# EAGLE design i2c_io_expander (EAGLE 7.5.0)
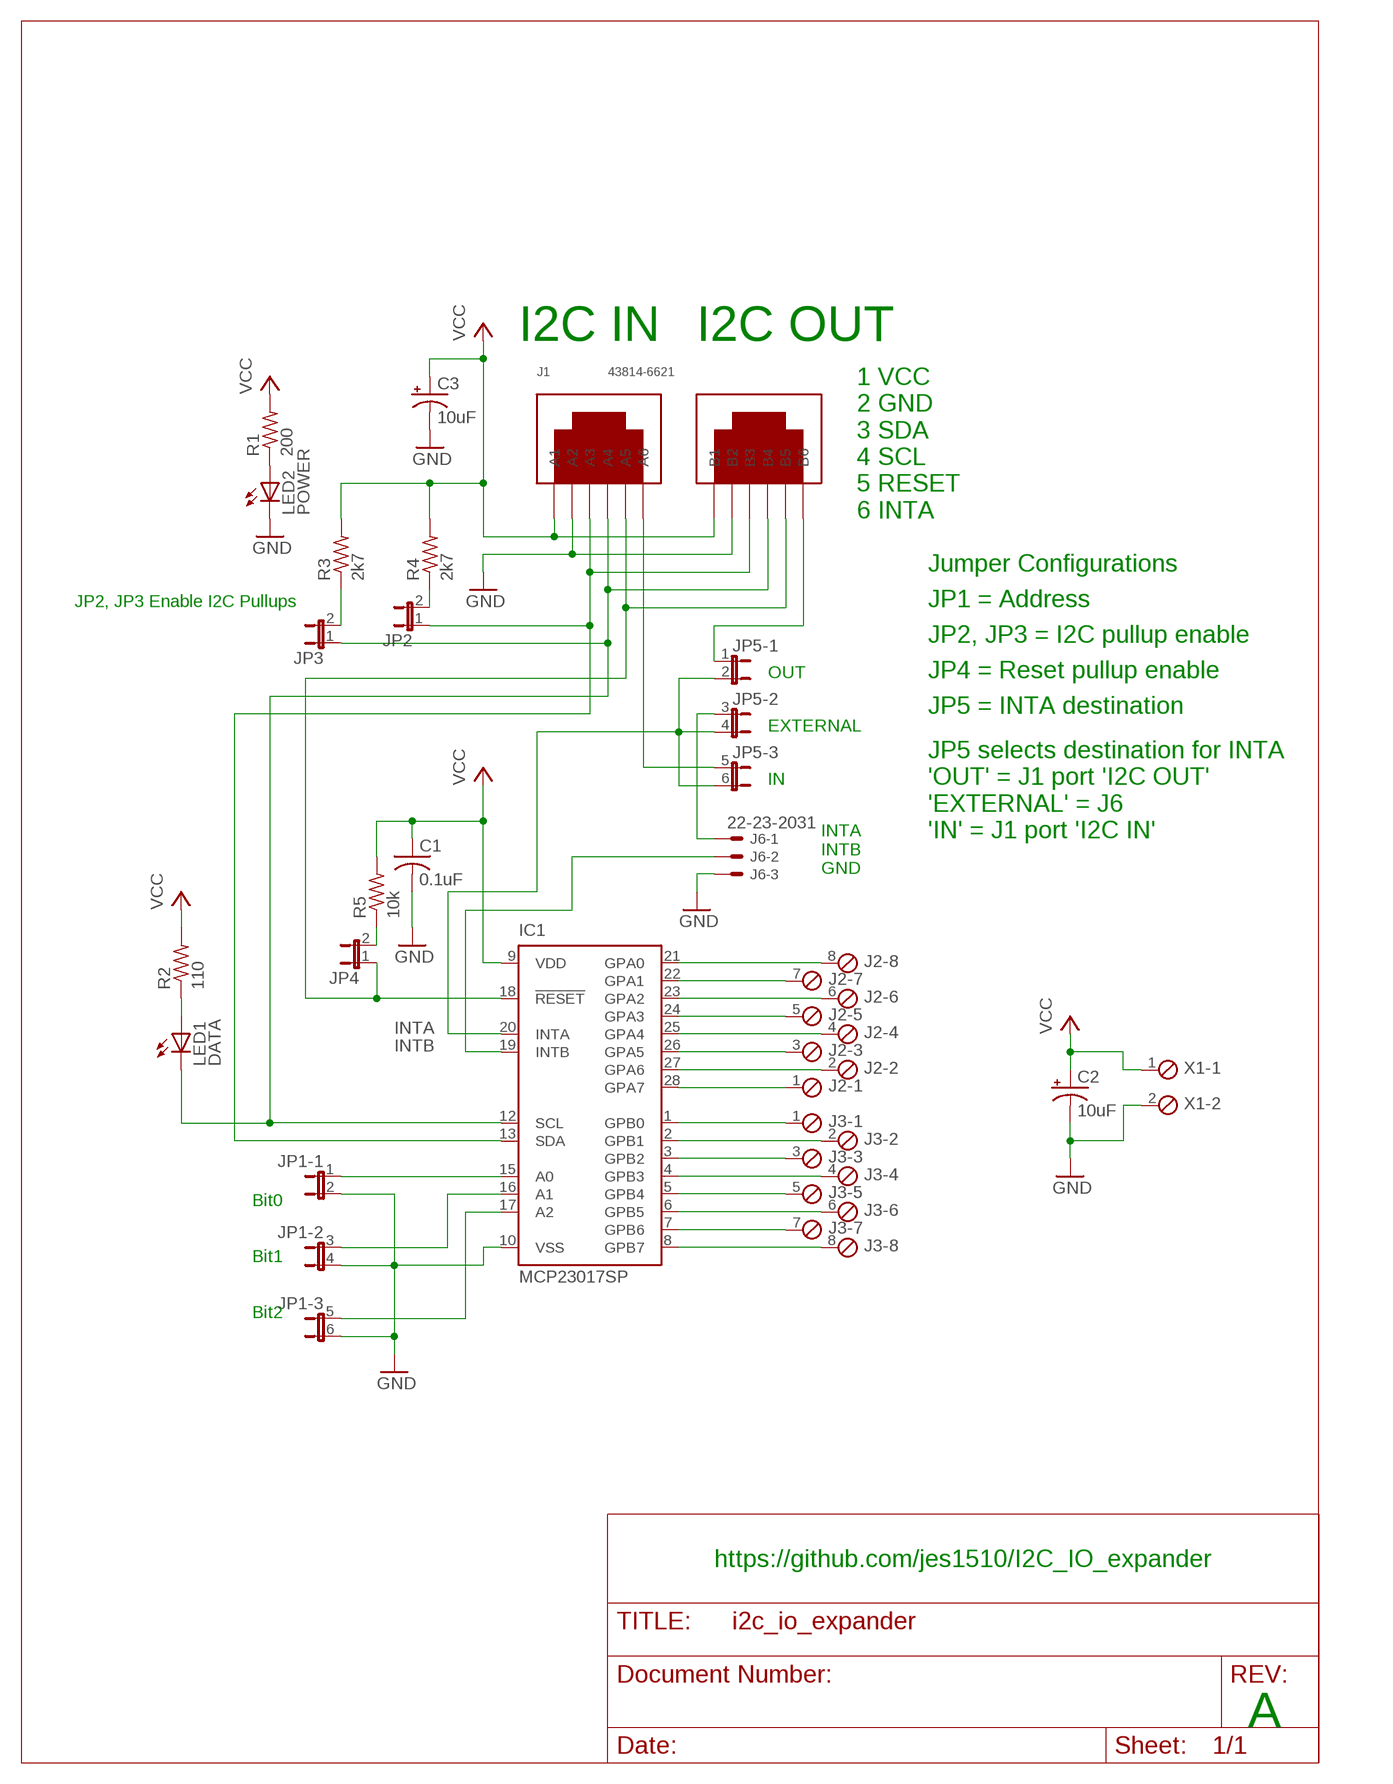
[diagram p0: schematic, sheet 1]

## Parts
C1  0.1uF  C-US025-025X050  [C025-025X050]
C2  10uF  CPOL-USE5-6  [E5-6]
C3  10uF  CPOL-USE5-6  [E5-6]
IC1  MCP23017SP  [DIL28-3]
J1  43814-6621  [43814-6621]
J2  MPT8  [8POL254]
J3  MPT8  [8POL254]
J6  22-23-2031  [22-23-2031]
JP1  JP3QE  [JP3Q]
JP2  JP1E  [JP1]
JP3  JP1E  [JP1]
JP4  JP1E  [JP1]
JP5  JP3QE  [JP3Q]
LED1  DATA  LED  [SMARTLED-TTW]
LED2  POWER  LED  [SMARTLED-TTW]
R1  200  R-US_R0603  [R0603]
R2  110  R-US_R0603  [R0603]
R3  2k7  R-US_R0603  [R0603]
R4  2k7  R-US_R0603  [R0603]
R5  10k  R-US_R0603  [R0603]
X1  MPT2  [2POL254]

## Nets
GND: C1.2 C2.- C3.- IC1.10(VSS) J1.A2 J1.B2 J6.3 JP1.2 JP1.4 JP1.6 LED2.C@1(C) X1.2
INTA: IC1.20(INTA) JP5.2 JP5.4 JP5.6
INTB: IC1.19(INTB) J6.2
N$1: IC1.15(A0) JP1.1
N$2: IC1.16(A1) JP1.3
N$3: IC1.17(A2) JP1.5
N$4: LED2.A@1(A) R1.1
N$5: J1.B6 JP5.1
N$6: JP3.2 R3.1
N$7: JP4.2 R5.1
N$8: J6.1 JP5.3
N$9: JP2.2 R4.1
N$10: LED1.A@1(A) R2.1
N$11: IC1.28(GPA7) J2.1
N$12: IC1.27(GPA6) J2.2
N$13: IC1.26(GPA5) J2.3
N$14: J1.A6 JP5.5
N$15: IC1.25(GPA4) J2.4
N$16: IC1.24(GPA3) J2.5
N$17: IC1.23(GPA2) J2.6
N$18: IC1.22(GPA1) J2.7
N$19: IC1.21(GPA0) J2.8
N$20: IC1.1(GPB0) J3.1
N$21: IC1.2(GPB1) J3.2
N$22: IC1.3(GPB2) J3.3
N$23: IC1.4(GPB3) J3.4
N$24: IC1.5(GPB4) J3.5
N$25: IC1.6(GPB5) J3.6
N$26: IC1.7(GPB6) J3.7
N$27: IC1.8(GPB7) J3.8
RESET: IC1.18(!RESET) J1.A5 J1.B5 JP4.1
SCL: IC1.12(SCL) J1.A4 J1.B4 JP3.1 LED1.C@1(C)
SDA: IC1.13(SDA) J1.A3 J1.B3 JP2.1
VCC: C1.1 C2.+ C3.+ IC1.9(VDD) J1.A1 J1.B1 R1.2 R2.2 R3.2 R4.2 R5.2 X1.1

## Notes on the sheet
- I2C IN | I2C OUT
- 1 VCC
  2 GND
  3 SDA
  4 SCL
  5 RESET
  6 INTA
- Jumper Configurations
- JP2, JP3 Enable I2C Pullups | JP1 = Address
- JP2, JP3 = I2C pullup enable
- OUT | JP4 = Reset pullup enable
- JP5 = INTA destination
- EXTERNAL
- IN
- JP5 selects destination for INTA
  'OUT' = J1 port 'I2C OUT'
  'EXTERNAL' = J6
  'IN' = J1 port 'I2C IN'
- INTA
  INTB
  GND
- Bit0
  
  
  Bit1
  
  
  Bit2
- https://github.com/jes1510/I2C_IO_expander
- A

## Library data of the parts
C1 = adafruit:C-US: CAPACITOR, American symbol; OC_NEWARK: unknown
C2 C3 = adafruit:CPOL-US: POLARIZED CAPACITOR, American symbol; OC_NEWARK: unknown
IC1 = adafruit:MCP23017: http://ww1.microchip.com/downloads/en/DeviceDoc/21952a.pdf Source: http://ww1.microchip.com/downloads/en/DeviceDoc/21952a.pdf; OC_NEWARK: unknown
J1 = jesse:43814-6621: Molex dual RJ11 jacks; MF: MOLEX; MPN: 43814-6621; OC_NEWARK: 57H0702
J2 = con-phoenix-254:MPT8: PHOENIX CONNECTOR; MF: FARNELL; MPN: 1725711; OC_FARNELL: unknown; OC_NEWARK: 71C4111
J3 = con-phoenix-254:MPT8: PHOENIX CONNECTOR; MF: FARNELL; MPN: 1725711; OC_FARNELL: 1725711; OC_NEWARK: 71C4111
J6 = con-molex:22-23-2031: .100" (2.54mm) Center Header - 3 Pin; OC_FARNELL: 1462950; OC_NEWARK: unknown
JP1 JP5 = jumper:JP3QE: JUMPER; OC_NEWARK: unknown
JP2-JP4 = jumper:JP1E: JUMPER; OC_NEWARK: unknown
LED1 LED2 = adafruit:LED: LED OSRAM: - CHIPLED LG R971, LG N971, LY N971, LG Q971, LY Q971, LO R971, LY R971 LH N974, LH R974 LS Q976, LO Q976, LY Q976 LO Q996 - Hyper CHIPLED LW Q18S LB Q993, LB Q99A, LB R99A - SideLED LS A670, LO A670, LY A670, LG A670, LP A670 LB A673, LV A673, LT A673, LW A673 LH A674 LY A675 LS A676, LA A676, LO A676, LY A676, LW A676 LS A679, LY A679, LG A679 - Hyper Micro SIDELED® LS Y876, LA Y876, LO Y876, LY Y876 LT Y87S - SmartLED LW L88C, LW L88S LB L89C, LB L89S, LG L890 LS L89K, LO L89K, LY L89K LS L896, LA L896, LO L896, LY L896 - TOPLED LS T670, LO T670, LY T670, LG T670, LP T670 LSG T670, LSP T670, LSY T670, LOP T670, LYG T670 LG T671, LOG T671, LSG T671 LB T673, LV T673, LT T673, LW T673 LH T674 LS T676, LA T676, LO T676, LY T676, LB T676, LH T676, LSB T676, LW T676 LB T67C, LV T67C, LT T67C, LS T67K, LO T67K, LY T67K, LW E67C LS E67B, LA E67B, LO E67B, LY E67B, LB E67C, LV E67C, LT E67C LW T67C LS T679, LY T679, LG T679 LS T770, LO T770, LY T770, LG T770, LP T770 LB T773, LV T773, LT T773, LW T773 LH T774 LS E675, LA E675, LY E675, LS T675 LS T776, LA T776, LO T776, LY T776, LB T776 LHGB T686 LT T68C, LB T68C - Hyper Mini TOPLED® LB M676 - Mini TOPLED Santana® LG M470 LS M47K, LO M47K, LY M47K Source: http://www.osram.convergy.de/; OC_NEWARK: unknown
R1-R5 = rcl:R-US_: RESISTOR, American symbol; OC_NEWARK: unknown
X1 = con-phoenix-254:MPT2: PHOENIX CONNECTOR; OC_FARNELL: unknown; OC_NEWARK: unknown

## Board
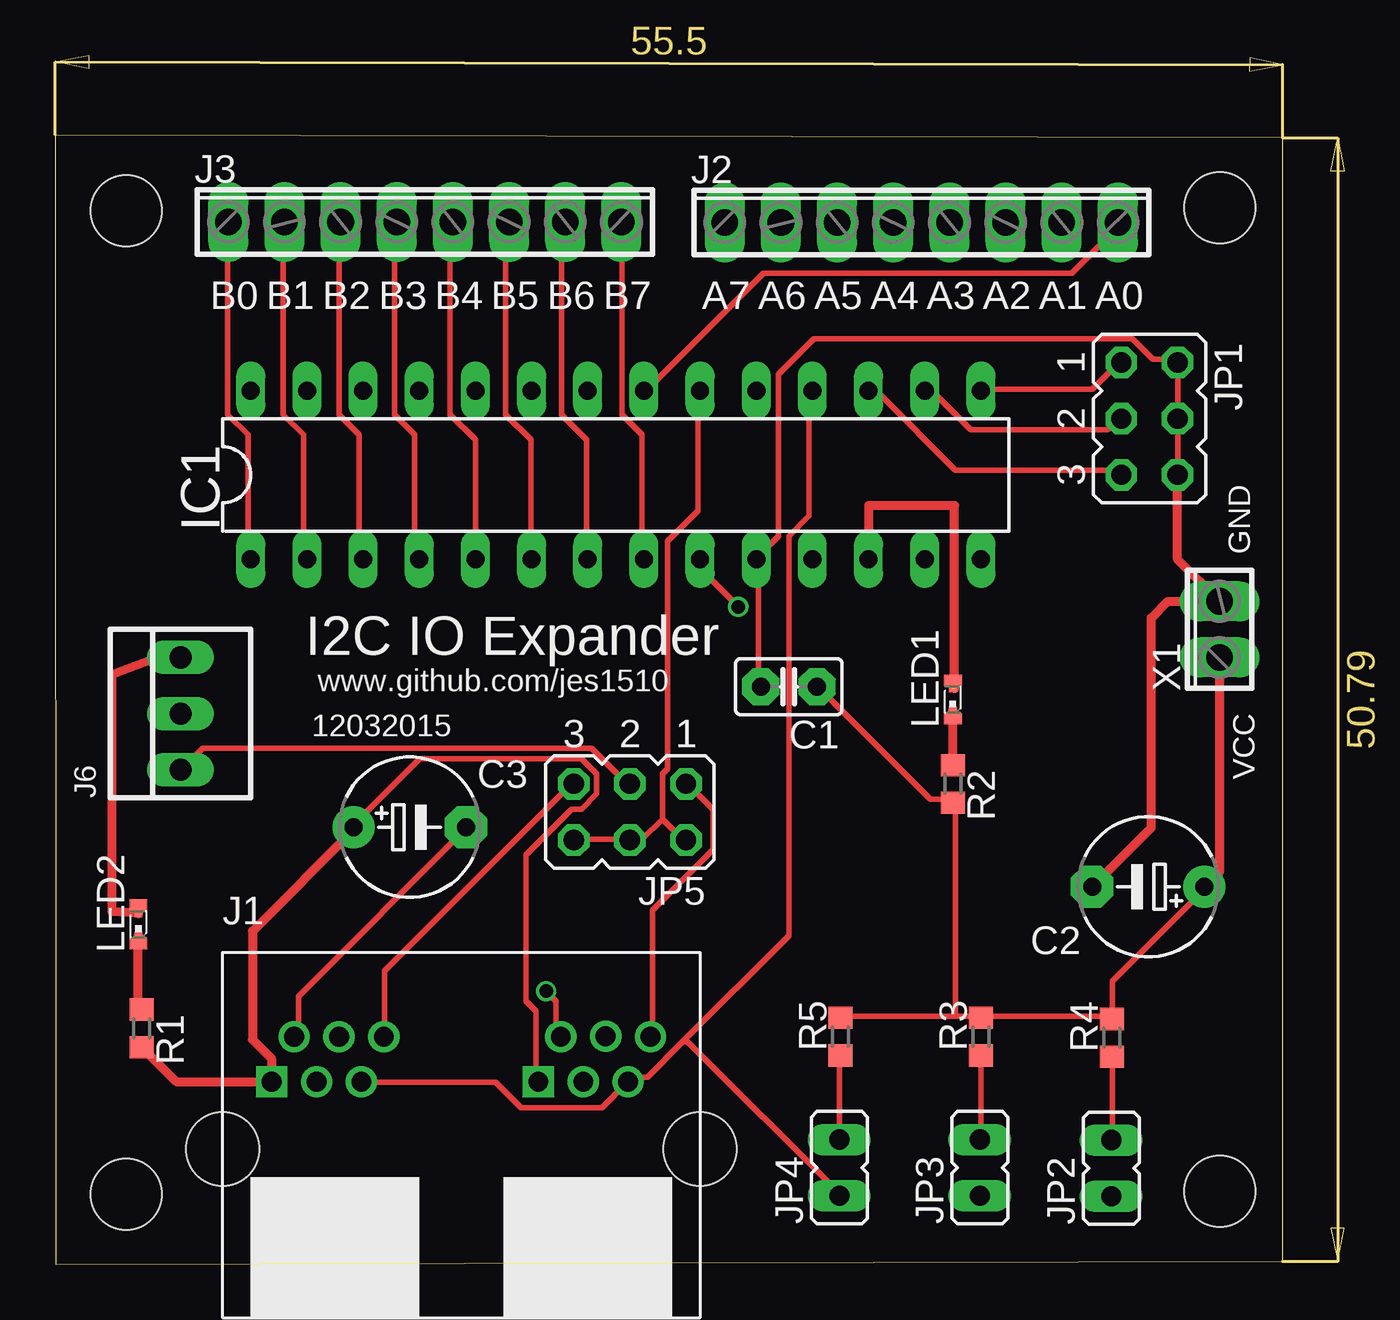
[diagram p1: board, top side]
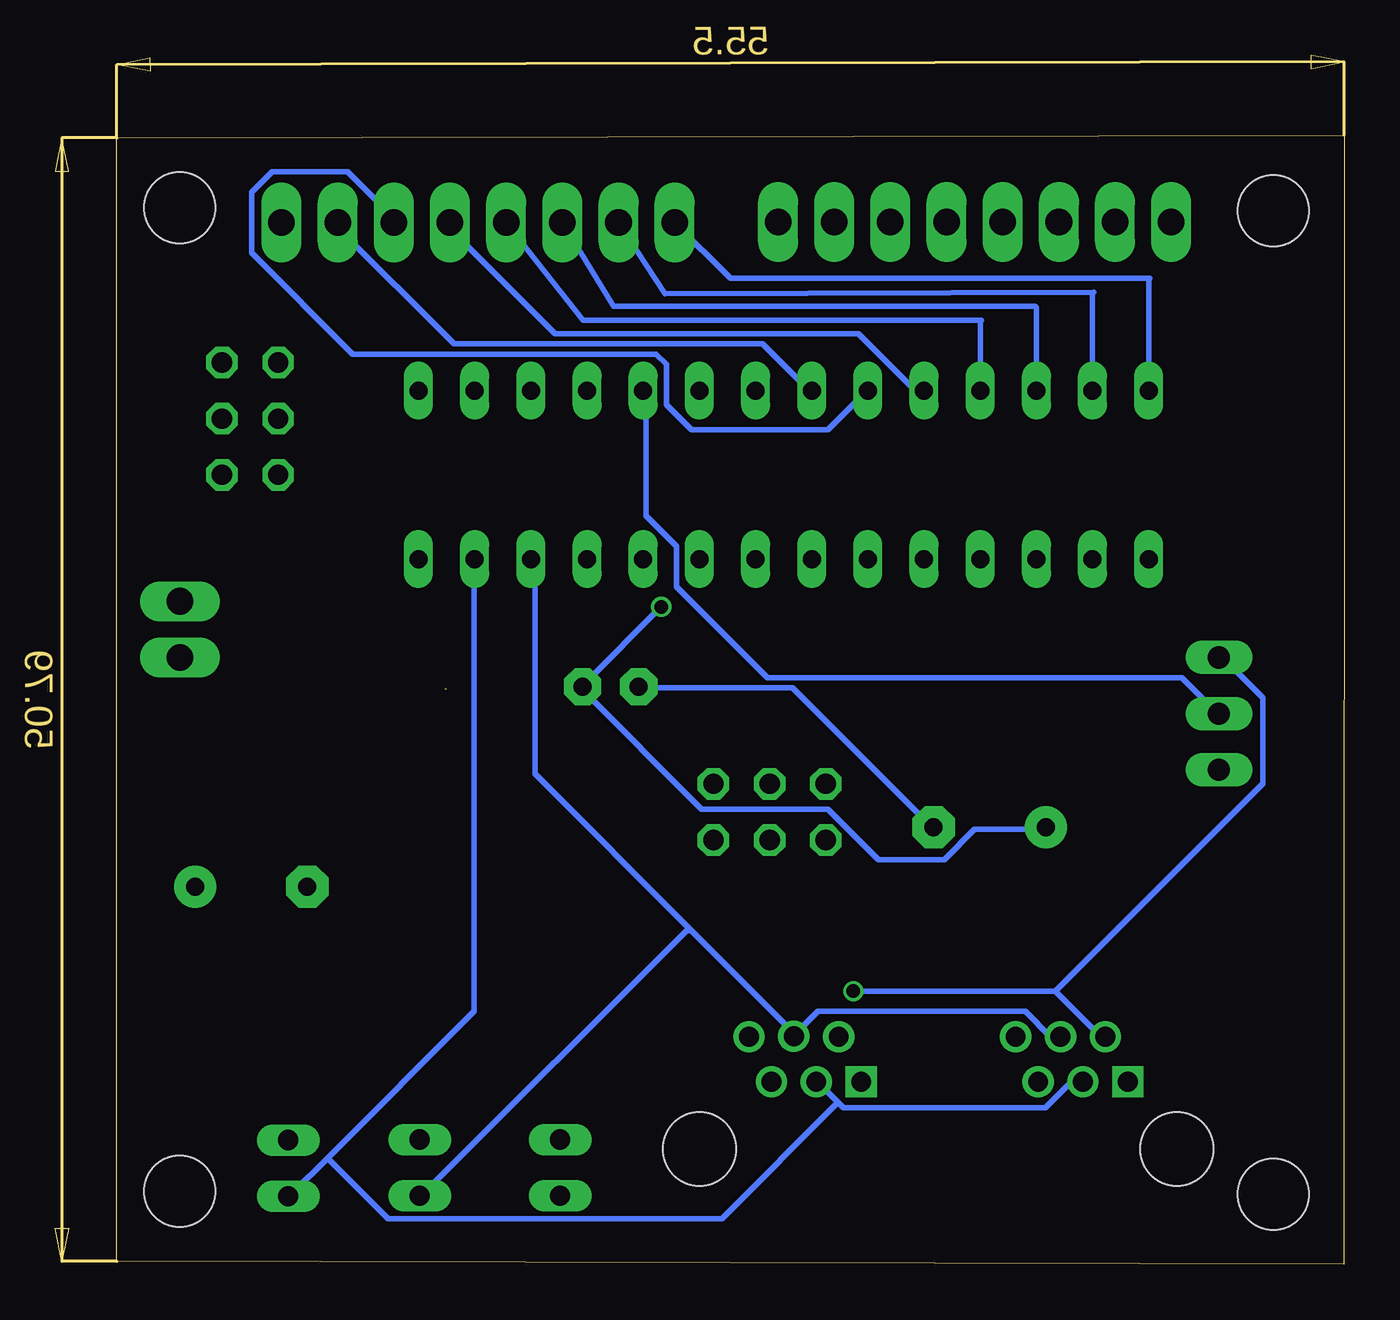
[diagram p2: board, bottom side, seen from below]

Size 55.5 x 51.04 mm. Coordinates in mm from the lower left corner, seen from the top.
Outline: 0.03,0 55.5,0.13 55.5,50.92 0,51.04 0.03,0
Copper layers (1*16): Top 0.035mm / dielectric 1.5mm / Bottom 0.035mm
Design rules "SeeedStudio_2layer_DRU_no_angle_20140221": minimum track width 6mil, minimum drill 12mil, track to track 6mil, track to pad 6mil, pad to pad 6mil, via to via 6mil, smd to smd 0mil, copper to edge 10mil, drill to drill 10mil, minimum pad ring 10mil, minimum via ring 6mil, stop-mask expansion 2mil, vias tented up to drill 100mil, thermal gap 10mil
Holes 3.2 mm at 52.65,47.75 3.2,3.17 3.2,47.62 52.65,3.3

### Footprints (pad centres in the part's own frame; a part is rotated, then mirrored left to right if it is on the bottom)
C025-025X050 = drill 0.813 pad 1.676 octagon: 1 -1.27,0; 2 1.27,0
E5-6 = drill 0.813 pad 1.905: + -2.54,0 | drill 0.813 pad 1.905 octagon: - 2.54,0
DIL28-3 = drill 0.813 long: 1 -16.51,-3.81; 2 -13.97,-3.81; 3 -11.43,-3.81; 4 -8.89,-3.81; 5 -6.35,-3.81; 6 -3.81,-3.81; 7 -1.27,-3.81; 8 1.27,-3.81; 9 3.81,-3.81; 10 6.35,-3.81; 11 8.89,-3.81; 12 11.43,-3.81; 13 13.97,-3.81; 14 16.51,-3.81; 15 16.51,3.81; 16 13.97,3.81; 17 11.43,3.81; 18 8.89,3.81; 19 6.35,3.81; 20 3.81,3.81; 21 1.27,3.81; 22 -1.27,3.81; 23 -3.81,3.81; 24 -6.35,3.81; 25 -8.89,3.81; 26 -11.43,3.81; 27 -13.97,3.81; 28 -16.51,3.81
43814-6621 = drill 0.9 square: A1 2.21,3.048; B1 14.275,3.048 | drill 0.9: A2 3.226,5.08; A3 4.242,3.048; A4 5.258,5.08; A5 6.274,3.048; A6 7.29,5.08; B2 15.291,5.08; B3 16.307,3.048; B4 17.323,5.105; B5 18.339,3.048; B6 19.355,5.08 | hole 3.302: 0,0; 21.59,0
8POL254 = drill 1.2 long: 1 -8.89,0; 2 -6.35,0; 3 -3.81,0; 4 -1.27,0; 5 1.27,0; 6 3.81,0; 7 6.35,0; 8 8.89,0
22-23-2031 = drill 1 long: 1 -2.54,0; 2 0,0; 3 2.54,0
JP3Q = drill 0.914 octagon: 1 -2.54,-1.27; 2 -2.54,1.27; 3 0,-1.27; 4 0,1.27; 5 2.54,-1.27; 6 2.54,1.27
JP1 = drill 0.914 long: 1 0,-1.27; 2 0,1.27
SMARTLED-TTW = smd 0.8 x 0.5: A 0,-0.875; C 0,0.875 | smd 0.35 x 0.35: A@1 0,-0.5; C@1 0,0.5
R0603 = smd 1 x 1.1: 1 -0.85,0; 2 0.85,0
2POL254 = drill 1.2 long: 1 -1.27,0; 2 1.27,0

### Placement (x,y rotation side)
C1  33.17,26.11 180 top
C2  49.43,17.07 180 top
C3  16.03,19.76 0 top
IC1  25.35,35.69 0 top
J1  7.57,5.21 0 top
J2  39.17,47.09 0 top
J3  16.71,47.12 0 top
J6  5.66,24.89 90 top
JP1  49.48,38.23 270 top
JP2  47.75,4.34 0 top
JP3  41.81,4.37 0 top
JP4  35.46,4.37 0 top
JP5  25.98,20.45 180 top
LED1  40.59,25.53 0 top
LED2  3.76,15.37 0 top
R1  3.91,10.67 270 top
R2  40.59,21.72 270 top
R3  41.86,10.29 90 top
R4  47.78,10.24 90 top
R5  35.51,10.29 90 top
X1  52.65,28.7 90 top

### Tracks (layer width: path | path; a pad name or v marks a point on that pad's centre or on a via)
GND  (via drill 0.61)
  Top 0.254: JP1.6 50.77,35.89 50.77,38.18 JP1.4 50.77,38.41 50.77,40.69 JP1.2 50.55,40.92 49.63,40.92 48.72,41.83 34.31,41.83 32.71,40.23 32.71,32.92 31.8,32 IC1.10 31.8,31.77 31.8,26.29 C1.2 | J1.A2 11,10.29 11,12.12 18.54,19.66 C3.- | v22.2,12.34 22.66,11.89 22.66,10.29 J1.B2
  Top 0.406: JP1.6 50.75,31.88 X1.2 50.32,29.97 49.55,29.21 49.55,19.74 C2.- | LED2.C@1 2.56,15.94 2.56,26.67 4.6,27.43 J6.3
  Bottom 0.254: 13.05,12.34 v22.2,12.34 | 13.05,12.34 11,10.29 J1.A2 | 13.05,12.34 3.68,21.72 3.68,25.6 5.51,27.43 J6.3 | C1.2 31.8,26.06 24.94,26.06 18.77,19.89 C3.-
INTA
  Top 0.254: JP5.6 23.57,19.2 25.86,19.2 JP5.4 26.08,19.2 26.54,19.2 27.46,20.12 | 27.46,20.12 27.46,22.17 27.69,22.4 27.69,32.69 29.06,34.06 29.06,39.32 IC1.20 | 27.46,20.12 28.37,19.2 JP5.2
INTB
  Bottom 0.254: IC1.19 31.57,39.32 31.57,33.83 30.2,32.46 30.2,30.63 26.08,26.52 7.34,26.52 5.74,24.92 J6.2
N$1
  Top 0.254: IC1.15 41.86,39.55 46.89,39.55 48.03,40.69 JP1.1
N$2
  Top 0.254: IC1.16 39.34,39.32 39.8,39.32 41.4,37.72 47.57,37.72 48.03,38.18 JP1.3
N$3
  Top 0.254: IC1.17 36.83,39.32 37.29,39.32 40.72,35.89 48.03,35.89 JP1.5
N$4
  Top 0.406: R1.1 3.76,11.67 LED2.A@1
N$5
  Top 0.254: J1.B6 27,10.29 27,16 29.74,18.75 29.74,20.57 28.6,21.72 JP5.1
N$6
  Top 0.254: R3.1 41.86,5.71 JP3.2
N$7
  Top 0.254: JP4.2 35.46,9.37 R5.1
N$8
  Top 0.254: JP5.3 25.86,21.72 24.26,23.32 6.65,23.32 5.74,22.4 J6.1
N$9
  Top 0.254: R4.1 47.8,9.37 47.8,5.71 JP2.2
N$10
  Top 0.406: R2.1 LED1.A@1
N$11
  Bottom 0.254: J2.1 27.76,44.58 8.79,44.58 8.84,44.53 IC1.28
N$12
  Bottom 0.254: J2.2 30.71,43.87 11.33,43.94 11.38,43.89 IC1.27
N$13
  Bottom 0.254: J2.3 33.05,43.31 14,43.31 13.92,43.23 IC1.26
N$14
  Top 0.254: J1.A6 14.88,10.29 14.88,13.26 23.34,21.72 JP5.5
N$15
  Bottom 0.254: J2.4 34.42,42.67 16.41,42.67 16.46,42.62 IC1.25
N$16
  Bottom 0.254: IC1.24 19,39.55 19.46,39.55 21.97,42.06 35.69,42.06 40.26,46.63 40.26,47.09 J2.5
N$17
  Bottom 0.254: IC1.23 21.74,39.32 23.34,37.72 29.51,37.72 30.66,38.86 30.66,40.69 31.11,41.15 44.83,41.15 49.4,45.72 49.4,48.46 48.49,49.38 45.06,49.38 42.77,47.09 J2.6
N$18
  Bottom 0.254: J2.7 45.52,46.86 40.26,41.6 26.31,41.6 24.26,39.55 IC1.22
N$19
  Top 0.254: IC1.21 26.77,39.55 32.03,44.81 45.97,44.81 48.26,47.09 J2.8
N$20
  Top 0.254: IC1.1 8.71,32 8.71,37.49 7.8,38.41 7.8,47.09 J3.1
N$21
  Top 0.254: IC1.2 11.23,32 11.23,37.49 10.31,38.41 10.31,47.09 J3.2
N$22
  Top 0.254: IC1.3 13.74,32 13.74,37.49 12.83,38.41 12.83,47.09 J3.3
N$23
  Top 0.254: IC1.4 16.26,32 16.26,37.49 15.34,38.41 15.34,47.09 J3.4
N$24
  Top 0.254: IC1.5 19,37.26 17.86,38.41 17.86,47.09 J3.5
N$25
  Top 0.254: IC1.6 21.51,32 21.51,37.26 20.37,38.41 20.37,47.09 J3.6
N$26
  Top 0.254: IC1.7 24.03,32 24.03,37.26 22.88,38.41 22.88,47.09 J3.7
N$27
  Top 0.254: IC1.8 26.54,32 26.54,37.49 25.63,38.41 25.63,47.09 J3.8
RESET
  Top 0.254: 28.37,10.06 26.77,8.46 26.08,8.46 J1.B5 25.86,8.23 24.71,7.09 21.06,7.09 19.91,8.23 13.97,8.23 J1.A5 | 28.37,10.06 33.17,14.86 33.17,32.92 34.09,33.83 34.09,39.32 IC1.18 | 28.37,10.06 28.6,10.06 35.46,3.2 JP4.1
SCL  (1 unrouted)
  Top 0.406: 40.66,26.03 40.66,34.29 36.78,34.29 IC1.12
  Bottom 0.254: 29.51,15.09 24.94,10.52 J1.B4 24.71,10.52 23.8,11.43 14.43,11.43 13.28,10.29 J1.A4 | 29.51,15.09 36.6,22.17 36.6,31.77 IC1.12 | 29.51,15.09 29.74,15.09 41.63,3.2 JP3.1
SDA
  Bottom 0.254: 22.88,7.32 23.8,8.23 J1.B3 | 22.88,7.32 22.66,7.09 13.51,7.09 12.37,8.23 11.91,8.23 J1.A3 | 45.97,4.8 47.57,3.2 JP2.1 | 45.97,4.8 39.34,11.43 39.34,31.77 IC1.13 | 22.88,7.32 28.14,2.06 43.23,2.06 45.97,4.8
VCC  (via drill 0.6, 0.61)
  Top 0.254: J1.B1 21.74,8.46 21.74,11.43 21.29,11.89 21.29,18.52 23.34,20.57 23.8,20.57 24.48,21.26 24.48,22.17 23.8,22.86 16.48,22.86 13.51,19.89 C3.+ | C1.1 34.54,26.06 39.57,21.03 40.49,21.03 R2.2 40.72,20.8 40.72,11.2 | 41.86,11.2 40.72,11.2 | 40.72,11.2 35.69,11.2 R5.2 | 41.86,11.2 47.57,11.2 R4.2 47.8,11.2 47.8,12.8 51.92,16.92 C2.+ | 41.86,11.2 R3.2 | v30.89,29.72 29.29,31.32 29.29,31.77 IC1.9
  Top 0.406: C2.+ 52.65,17.75 X1.1 | R1.2 5.47,8.26 J1.A1 9.78,9.3 8.92,10.16 8.92,15.06 v13.51,19.66
  Bottom 0.254: C3.+ v13.51,19.66 16.71,19.66 18.08,18.29 21.06,18.29 23.34,20.57 29.06,20.57 34.54,26.06 C1.1 34.31,26.29 v30.89,29.72

### Text on the board
tPlace: B0 | B1 | B2 | B3 | B4 | B5 | B6 | B7 | A7 | A6 | A5 | A4 | A3 | A2 | A1 | A0 | GND | I2C IO Expander | www.github.com/jes1510 | 12032015 | VCC